# EAGLE schematic 808_bass_drum1 (EAGLE 9.0.0)
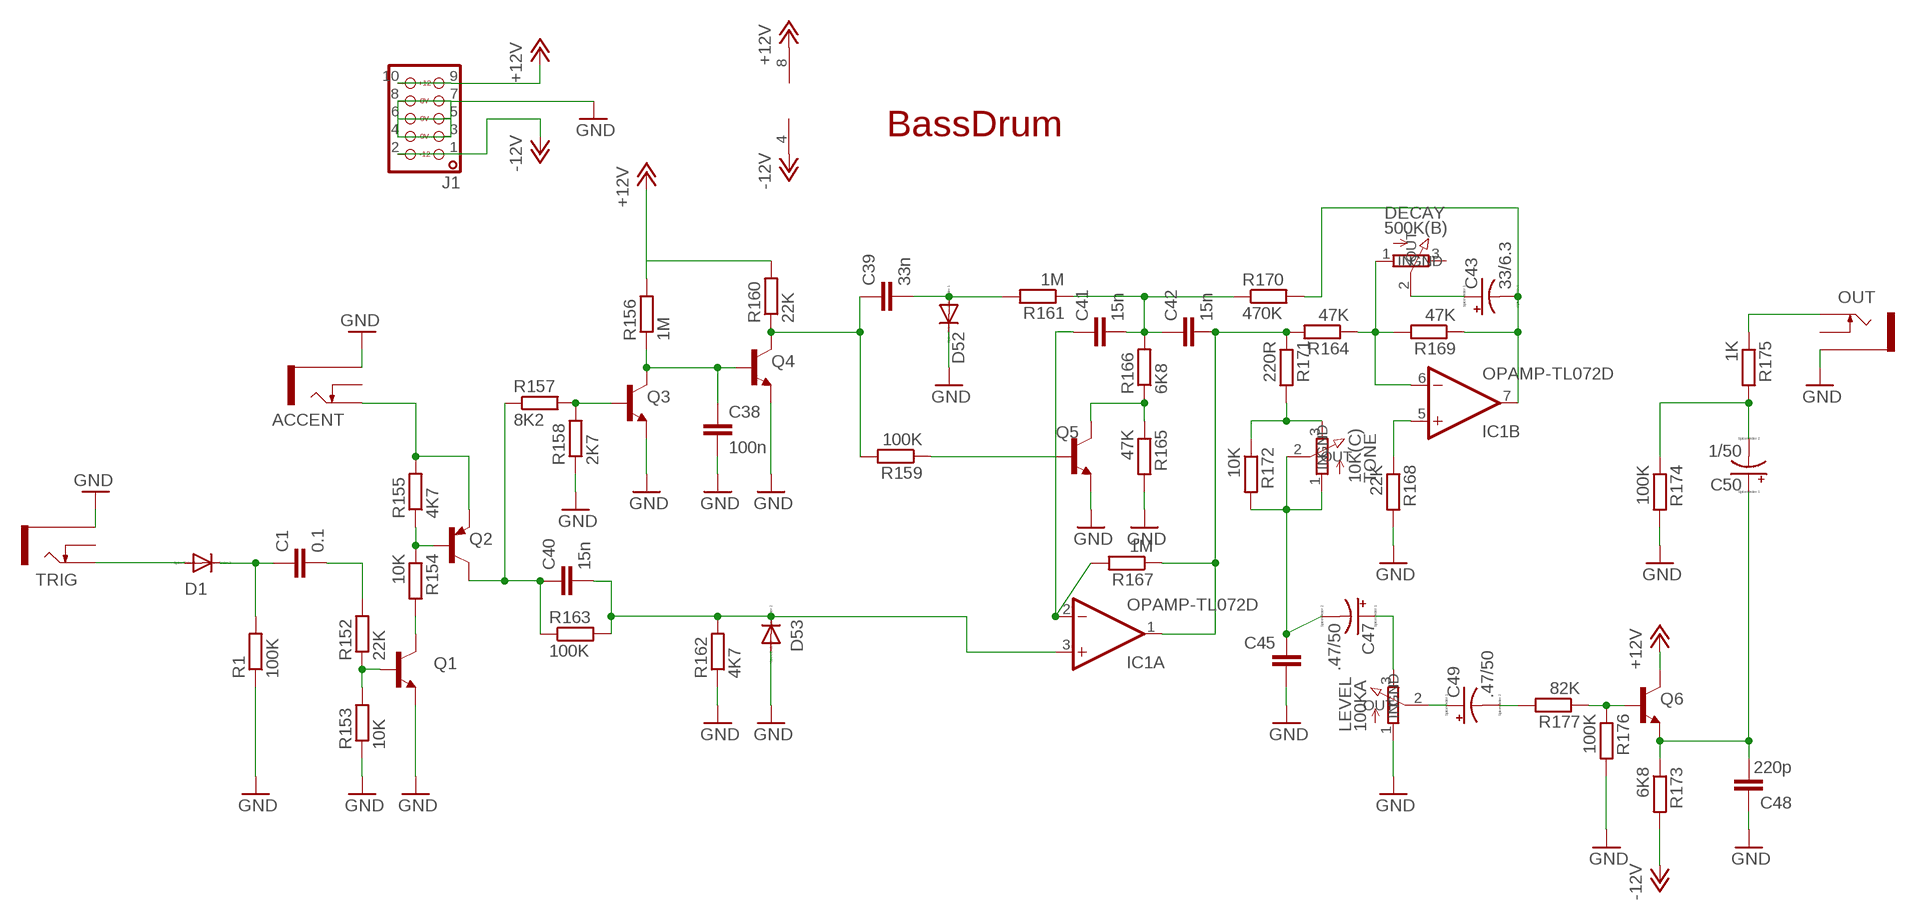
[diagram p0: schematic, sheet 1]

## Parts
ACCENT  JACK_THONKICONNNEW  [WQP-PJ301M-12_JACK]
C1  0.1  CAPACITOR-EUC0603  [C0603]
C38  100n  CAPACITOR-EUC0603  [C0603]
C39  33n  CAPACITOR-EUC0603  [C0603]
C40  15n  CAPACITOR-EUC0603  [C0603]
C41  15n  CAPACITOR-EUC0603  [C0603]
C42  15n  CAPACITOR-EUC0603  [C0603]
C43  33/6.3  CAPACITOR_POLARIZED-USE2.5-5  [E2,5-5]
C45  100n  CAPACITOR-EUC0603  [C0603]
C47  .47/50  CAPACITOR_POLARIZED-USE2.5-5  [E2,5-5]
C48  220p  CAPACITOR-EUC0603  [C0603]
C49  .47/50  CAPACITOR_POLARIZED-USE2.5-5  [E2,5-5]
C50  1/50  CAPACITOR_POLARIZED-USE2.5-5  [E2,5-5]
D1  1N4148  DIODE-1N4148SOD-323  [SOD323W_INFINEON]
D52  1N4148  DIODE-1N4148SOD-323  [SOD323W_INFINEON]
D53  1N4148  DIODE-1N4148SOD-323  [SOD323W_INFINEON]
DECAY  500K(B)  POT_9MM_PCB-PLS  [9MM_PLS]
IC1  OPAMP-TL072D  [SO08]
J1  HEADER-EUROPWR_2X05-OPEN  [2X05_EUROPWR_OPEN]
LEVEL  100KA  POT_9MM_PCB-PLS  [9MM_PLS]
OUT  JACK_THONKICONNNEW  [WQP-PJ301M-12_JACK]
Q1  bc546  TRANSISTOR-NPN-BC846ALT1SOT23-BEC  [SOT23-BEC]
Q2  bc556  TRANSISTOR-PNP-BC856BLT1SOT23-BEC  [SOT23-BEC]
Q3  bc546  TRANSISTOR-NPN-BC846BLT1SOT23-BEC  [SOT23-BEC]
Q4  bc546  TRANSISTOR-NPN-BC846BLT1SOT23-BEC  [SOT23-BEC]
Q5  bc546  TRANSISTOR-NPN-BC846ALT1SOT23-BEC  [SOT23-BEC]
Q6  bc546  TRANSISTOR-NPN-BC846ALT1SOT23-BEC  [SOT23-BEC]
R1  100K  RESISTOR-EU_R0603  [R0603]
R152  22K  RESISTOR-EU_R0603  [R0603]
R153  10K  RESISTOR-EU_R0603  [R0603]
R154  10K  RESISTOR-EU_R0603  [R0603]
R155  4K7  RESISTOR-EU_R0603  [R0603]
R156  1M  RESISTOR-EU_R0603  [R0603]
R157  8K2  RESISTOR-EU_R0603  [R0603]
R158  2K7  RESISTOR-EU_R0603  [R0603]
R159  100K  RESISTOR-EU_R0603  [R0603]
R160  22K  RESISTOR-EU_R0603  [R0603]
R161  1M  RESISTOR-EU_R0603  [R0603]
R162  4K7  RESISTOR-EU_R0603  [R0603]
R163  100K  RESISTOR-EU_R0603  [R0603]
R164  47K  RESISTOR-EU_R0603  [R0603]
R165  47K  RESISTOR-EU_R0603  [R0603]
R166  6K8  RESISTOR-EU_R0603  [R0603]
R167  1M  RESISTOR-EU_R0603  [R0603]
R168  22K  RESISTOR-EU_R0603  [R0603]
R169  47K  RESISTOR-EU_R0603  [R0603]
R170  470K  RESISTOR-EU_R0603  [R0603]
R171  220R  RESISTOR-EU_R0603  [R0603]
R172  10K  RESISTOR-EU_R0603  [R0603]
R173  6K8  RESISTOR-EU_R0603  [R0603]
R174  100K  RESISTOR-EU_R0603  [R0603]
R175  1K  RESISTOR-EU_R0603  [R0603]
R176  100K  RESISTOR-EU_R0603  [R0603]
R177  82K  RESISTOR-EU_R0603  [R0603]
TONE  10K(C)  POT_9MM_PCB-PLS  [9MM_PLS]
TRIG  JACK_THONKICONNNEW  [WQP-PJ301M-12_JACK]

## Nets
+12V [GND]: IC1.8(P:V+) J1.9 J1.10 Q6.C R156.2 R160.2
-12V [GND]: IC1.4(P:V-) J1.1 J1.2 R173.2
C49: C49.- R177.2
GND [GND]: ACCENT.P$3_SLEEVE(SLEEVE) C38.2 C45.2 C48.1 D52.C D53.A J1.3 J1.4 J1.5 J1.6 J1.7 J1.8 LEVEL.1(GND) OUT.P$3_SLEEVE(SLEEVE) Q1.E Q3.E Q4.E Q5.E R1.1 R153.1 R158.1 R162.1 R165.2 R168.2 R174.2 R176.2 TRIG.P$3_SLEEVE(SLEEVE)
N$1: DECAY.1(GND) IC1.6(B:-IN) R164.1 R169.2
N$2: IC1.5(B:+IN) R168.1
N$3: OUT.P$1_TIP(TIP) R175.1
N$4: D1.A TRIG.P$1_TIP(TIP)
N$5: C1.1 D1.C R1.2
N$6: C1.2 R152.2
N$162: C38.1 Q3.C Q4.B R156.1
N$164: Q2.B R154.1 R155.1
N$168: Q5.C R165.1 R166.1
N$169: Q3.B R157.2 R158.2
N$188: Q1.C R154.2
N$190: C39.1 Q4.C R159.2 R160.1
N$191: C40.1 Q2.C R157.1 R163.1
N$192: C40.2 D53.C IC1.3(A:+IN) R162.2 R163.2
N$193: Q5.B R159.1
N$195: C41.2 C42.1 R161.1 R166.2 R170.1
N$196: C41.1 IC1.2(A:-IN) R167.2
N$197: C42.2 IC1.1(A:OUT) R164.2 R167.1 R171.1
N$198: C45.1 C47.- R172.2 TONE.1(GND) TONE.2(OUT)
N$199: R171.2 R172.1 TONE.3(IN)
N$202: C43.- IC1.7(B:OUT) R169.1 R170.2
N$203: Q6.B R176.1 R177.1
N$204: C48.2 C50.+ Q6.E R173.1
N$205: C50.- R174.1 R175.2
N$206: C47.+ LEVEL.3(IN)
N$207: C49.+ LEVEL.2(OUT)
N$208: C43.+ DECAY.2(OUT)
N$217: Q1.B R152.1 R153.2
N$242: C39.2 D52.A R161.2
TRIG: ACCENT.P$1_TIP(TIP) Q2.E R155.2
Unconnected: ACCENT.P$2_SWITCH(SWITCH) DECAY.3(IN) OUT.P$2_SWITCH(SWITCH) TRIG.P$2_SWITCH(SWITCH)

## Notes on the sheet
- BassDrum

## Library data of the parts
ACCENT OUT TRIG = 0000-master:JACK_THONKICONN: 3.5mm socket for Eurorack modular synths
C1 C38-C42 C45 C48 = 0000-master:CAPACITOR-EU: CAPACITOR, European symbol
C43 C47 C49 C50 = 0000-master:CAPACITOR_POLARIZED-US: POLARIZED CAPACITOR, American symbol
D1 D52 D53 = 0000-master:DIODE-1N4148: DIODE high speed (Philips)
DECAY LEVEL TONE = 0000-master:POT_9MM_PCB: 9 mm Square Rotary Potentiometers Source: Panasonic
IC1 = 0000-master:OPAMP-TL072: OP AMP
J1 = 0000-master:HEADER-EUROPWR_2X05: 2x05 pin header
Q1 Q3-Q6 = 0000-master:TRANSISTOR-NPN-: NPN Transistror BF959 corrected 2008.03.06
Q2 = 0000-master:TRANSISTOR-PNP-: PNP Transistror
R1 R152-R177 = 0000-master:RESISTOR-EU_: RESISTOR, European symbol

## Net classes
0 default: width 0.203 mm, drill 0.356 mm, clearance 0.203 mm
1 GND: width 0.203 mm, drill 0.356 mm, clearance 0.203 mm